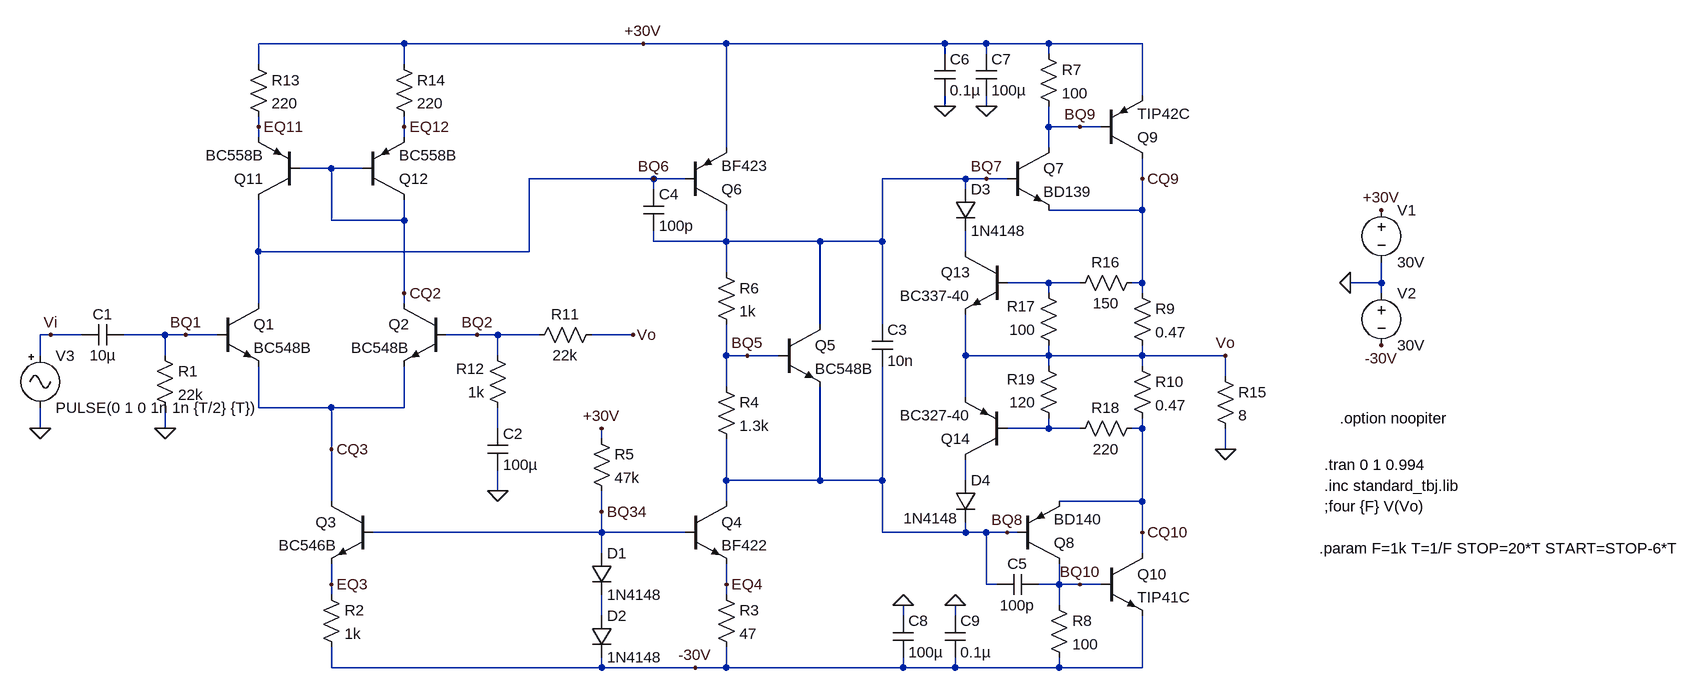
[diagram p0: schematic Clase_B_v3.asc]
Clase_B_v3.asc, the LTspice schematic file:
Version 4
SHEET 1 2480 1108
WIRE 96 -224 -128 -224
WIRE 464 -224 96 -224
WIRE 592 -224 464 -224
WIRE 928 -224 592 -224
WIRE 992 -224 928 -224
WIRE 1088 -224 992 -224
WIRE 1232 -224 1088 -224
WIRE 928 -208 928 -224
WIRE 992 -208 992 -224
WIRE 1088 -208 1088 -224
WIRE -128 -192 -128 -224
WIRE 96 -192 96 -224
WIRE 1232 -144 1232 -224
WIRE 928 -128 928 -144
WIRE 992 -128 992 -144
WIRE -128 -96 -128 -112
WIRE 96 -96 96 -112
WIRE 1088 -96 1088 -128
WIRE 1136 -96 1088 -96
WIRE 1168 -96 1136 -96
WIRE -128 -80 -128 -96
WIRE 96 -80 96 -96
WIRE 592 -64 592 -224
WIRE 1088 -64 1088 -96
WIRE -16 -32 -64 -32
WIRE 32 -32 -16 -32
WIRE 480 -16 288 -16
WIRE 528 -16 480 -16
WIRE 960 -16 832 -16
WIRE 992 -16 960 -16
WIRE 1024 -16 992 -16
WIRE 1232 -16 1232 -48
WIRE 480 0 480 -16
WIRE 960 0 960 -16
WIRE 1232 32 1232 -16
WIRE 1232 32 1088 32
WIRE -16 48 -16 -32
WIRE 96 48 96 16
WIRE 96 48 -16 48
WIRE 480 80 480 64
WIRE 592 80 592 32
WIRE 592 80 480 80
WIRE 736 80 592 80
WIRE 832 80 832 -16
WIRE 832 80 736 80
WIRE -128 96 -128 16
WIRE 288 96 288 -16
WIRE 288 96 -128 96
WIRE 960 96 960 64
WIRE 592 128 592 80
WIRE 1088 144 1024 144
WIRE 1136 144 1088 144
WIRE 1232 144 1232 32
WIRE 1232 144 1216 144
WIRE 1600 144 1600 112
WIRE 1600 144 1552 144
WIRE 96 160 96 48
WIRE 1088 160 1088 144
WIRE 1232 160 1232 144
WIRE 1600 160 1600 144
WIRE -128 176 -128 96
WIRE 96 176 96 160
WIRE 736 208 736 80
WIRE 832 208 832 80
WIRE -448 224 -464 224
WIRE -400 224 -448 224
WIRE -272 224 -336 224
WIRE -240 224 -272 224
WIRE -192 224 -240 224
WIRE 208 224 160 224
WIRE 240 224 208 224
WIRE 304 224 240 224
WIRE 448 224 384 224
WIRE -464 256 -464 224
WIRE -272 256 -272 224
WIRE 240 256 240 224
WIRE 592 256 592 208
WIRE 624 256 592 256
WIRE 672 256 624 256
WIRE 960 256 960 192
WIRE 1088 256 1088 240
WIRE 1088 256 960 256
WIRE 1232 256 1232 240
WIRE 1232 256 1088 256
WIRE 1360 256 1232 256
WIRE 1088 272 1088 256
WIRE 1232 272 1232 256
WIRE 1360 288 1360 256
WIRE 592 304 592 256
WIRE 960 320 960 256
WIRE -128 336 -128 272
WIRE -16 336 -128 336
WIRE 96 336 96 272
WIRE 96 336 -16 336
WIRE -464 368 -464 336
WIRE -272 368 -272 336
WIRE 240 368 240 336
WIRE 1088 368 1088 352
WIRE 1088 368 1024 368
WIRE 1136 368 1088 368
WIRE 1232 368 1232 352
WIRE 1232 368 1216 368
WIRE 400 384 400 368
WIRE -16 400 -16 336
WIRE 1360 400 1360 368
WIRE 592 448 592 384
WIRE 736 448 736 304
WIRE 736 448 592 448
WIRE 832 448 832 272
WIRE 832 448 736 448
WIRE 960 448 960 416
WIRE 240 464 240 432
WIRE -16 480 -16 400
WIRE 592 480 592 448
WIRE 1232 480 1232 368
WIRE 1232 480 1104 480
WIRE 400 496 400 464
WIRE 400 528 400 496
WIRE 400 528 48 528
WIRE 528 528 400 528
WIRE 832 528 832 448
WIRE 960 528 960 512
WIRE 960 528 832 528
WIRE 992 528 960 528
WIRE 1024 528 992 528
WIRE 1040 528 1024 528
WIRE 1232 528 1232 480
WIRE 400 560 400 528
WIRE 1232 560 1232 528
WIRE -16 608 -16 576
WIRE 592 608 592 576
WIRE 992 608 992 528
WIRE 1008 608 992 608
WIRE 1104 608 1104 576
WIRE 1104 608 1072 608
WIRE 1136 608 1104 608
WIRE 1168 608 1136 608
WIRE -16 624 -16 608
WIRE 592 624 592 608
WIRE 1104 640 1104 608
WIRE 400 656 400 624
WIRE 864 656 864 640
WIRE 944 656 944 640
WIRE -16 736 -16 704
WIRE 400 736 400 720
WIRE 400 736 -16 736
WIRE 544 736 400 736
WIRE 592 736 592 704
WIRE 592 736 544 736
WIRE 864 736 864 720
WIRE 864 736 592 736
WIRE 944 736 944 720
WIRE 944 736 864 736
WIRE 1104 736 1104 720
WIRE 1104 736 944 736
WIRE 1232 736 1232 656
WIRE 1232 736 1104 736
FLAG 1552 144 0
FLAG 1600 32 +30V
FLAG 464 -224 +30V
FLAG 1600 240 -30V
FLAG 544 736 -30V
FLAG 240 464 0
FLAG -464 368 0
FLAG 1360 256 Vo
FLAG -448 224 Vi
FLAG 480 -16 BQ6
FLAG -16 400 CQ3
FLAG -16 608 EQ3
FLAG 400 496 BQ34
FLAG 592 608 EQ4
FLAG 992 -16 BQ7
FLAG 1024 528 BQ8
FLAG 1136 -96 BQ9
FLAG 1136 608 BQ10
FLAG 1232 528 CQ10
FLAG 1232 -16 CQ9
FLAG -272 368 0
FLAG 448 224 Vo
FLAG -128 -96 EQ11
FLAG 96 -96 EQ12
FLAG 96 160 CQ2
FLAG 208 224 BQ2
FLAG -240 224 BQ1
FLAG 624 256 BQ5
FLAG 400 368 +30V
FLAG 992 -128 0
FLAG 864 640 0
FLAG 928 -128 0
FLAG 944 640 0
FLAG 1360 400 0
SYMBOL npn -192 176 R0
SYMATTR InstName Q1
SYMATTR Value BC548B
SYMBOL npn 160 176 M0
SYMATTR InstName Q2
SYMATTR Value BC548B
SYMBOL npn 48 480 M0
SYMATTR InstName Q3
SYMATTR Value BC546B
SYMBOL npn 528 480 R0
SYMATTR InstName Q4
SYMATTR Value BF422
SYMBOL npn 672 208 R0
SYMATTR InstName Q5
SYMATTR Value BC548B
SYMBOL pnp 528 32 M180
SYMATTR InstName Q6
SYMATTR Value BF423
SYMBOL res 576 112 R0
SYMATTR InstName R6
SYMATTR Value 1k
SYMBOL res 576 288 R0
SYMATTR InstName R4
SYMATTR Value 1.3k
SYMBOL diode 384 560 R0
SYMATTR InstName D1
SYMATTR Value 1N4148
SYMBOL diode 384 656 R0
SYMATTR InstName D2
SYMATTR Value 1N4148
SYMBOL res -32 608 R0
SYMATTR InstName R2
SYMATTR Value 1k
SYMBOL res 576 608 R0
SYMATTR InstName R3
SYMATTR Value 47
SYMBOL res 384 368 R0
SYMATTR InstName R5
SYMATTR Value 47k
SYMBOL voltage 1600 16 R0
WINDOW 123 0 0 Left 2
WINDOW 39 0 0 Left 2
SYMATTR InstName V1
SYMATTR Value 30V
SYMBOL voltage 1600 144 R0
SYMATTR InstName V2
SYMATTR Value 30V
SYMBOL res 1216 144 R0
SYMATTR InstName R9
SYMATTR Value 0.47
SYMBOL res 1216 256 R0
SYMATTR InstName R10
SYMATTR Value 0.47
SYMBOL npn 1024 -64 R0
SYMATTR InstName Q7
SYMATTR Value BD139
SYMBOL pnp 1168 -48 M180
SYMATTR InstName Q9
SYMATTR Value TIP42C
SYMBOL res 1072 -224 R0
SYMATTR InstName R7
SYMATTR Value 100
SYMBOL pnp 1040 576 M180
SYMATTR InstName Q8
SYMATTR Value BD140
SYMBOL npn 1168 560 R0
SYMATTR InstName Q10
SYMATTR Value TIP41C
SYMBOL res 1088 624 R0
SYMATTR InstName R8
SYMATTR Value 100
SYMBOL res 400 208 R90
WINDOW 0 0 56 VBottom 2
WINDOW 3 32 56 VTop 2
SYMATTR InstName R11
SYMATTR Value 22k
SYMBOL res 256 352 R180
WINDOW 0 36 76 Left 2
WINDOW 3 36 40 Left 2
SYMATTR InstName R12
SYMATTR Value 1k
SYMBOL cap 464 0 R0
SYMATTR InstName C4
SYMATTR Value 100p
SYMBOL cap 224 368 R0
SYMATTR InstName C2
SYMATTR Value 100µ
SYMBOL cap -400 240 R270
WINDOW 0 32 32 VTop 2
WINDOW 3 0 32 VBottom 2
SYMATTR InstName C1
SYMATTR Value 10µ
SYMBOL res -288 240 R0
SYMATTR InstName R1
SYMATTR Value 22k
SYMBOL pnp -64 16 R180
SYMATTR InstName Q11
SYMATTR Value BC558B
SYMBOL pnp 32 16 M180
SYMATTR InstName Q12
SYMATTR Value BC558B
SYMBOL res -144 -208 R0
SYMATTR InstName R13
SYMATTR Value 220
SYMBOL res 80 -208 R0
SYMATTR InstName R14
SYMATTR Value 220
SYMBOL cap 1072 592 R90
WINDOW 0 0 32 VBottom 2
WINDOW 3 32 32 VTop 2
SYMATTR InstName C5
SYMATTR Value 100p
SYMBOL cap 816 208 R0
SYMATTR InstName C3
SYMATTR Value 10n
SYMBOL cap 976 -208 R0
SYMATTR InstName C7
SYMATTR Value 100µ
SYMBOL cap 848 656 R0
SYMATTR InstName C8
SYMATTR Value 100µ
SYMBOL Misc\\signal -464 240 R0
WINDOW 123 0 0 Left 0
WINDOW 39 0 0 Left 0
SYMATTR InstName V3
SYMATTR Value PULSE(0 1 0 1n 1n {T/2} {T})
SYMBOL res 1232 128 R90
WINDOW 0 0 56 VBottom 2
WINDOW 3 32 56 VTop 2
SYMATTR InstName R16
SYMATTR Value 150
SYMBOL res 1104 256 R180
WINDOW 0 36 76 Left 2
WINDOW 3 36 40 Left 2
SYMATTR InstName R17
SYMATTR Value 100
SYMBOL res 1120 384 R270
WINDOW 0 32 56 VTop 2
WINDOW 3 0 56 VBottom 2
SYMATTR InstName R18
SYMATTR Value 220
SYMBOL res 1104 368 R180
WINDOW 0 36 76 Left 2
WINDOW 3 36 40 Left 2
SYMATTR InstName R19
SYMATTR Value 120
SYMBOL npn 1024 96 M0
SYMATTR InstName Q13
SYMATTR Value BC337-40
SYMBOL pnp 1024 416 R180
SYMATTR InstName Q14
SYMATTR Value BC327-40
SYMBOL diode 944 0 R0
SYMATTR InstName D3
SYMATTR Value 1N4148
SYMBOL diode 944 448 R0
WINDOW 3 -80 58 Left 2
SYMATTR Value 1N4148
SYMATTR InstName D4
SYMBOL cap 912 -208 R0
SYMATTR InstName C6
SYMATTR Value 0.1µ
SYMBOL cap 928 656 R0
SYMATTR InstName C9
SYMATTR Value 0.1µ
SYMBOL res 1344 272 R0
SYMATTR InstName R15
SYMATTR Value 8
TEXT 1512 456 Left 2 !.inc standard_tbj.lib
TEXT 1512 488 Left 2 !;four {F} V(Vo)
TEXT 1504 552 Left 2 !.param F=1k T=1/F STOP=20*T START=STOP-6*T
TEXT 1512 424 Left 2 !.tran 0 1 0.994
TEXT 1536 352 Left 2 !.option noopiter

The netlist it stands for:
* Clase_B_v3.asc
Q1 BQ6 BQ1 CQ3 0 BC548B
Q2 CQ2 BQ2 CQ3 0 BC548B
Q3 CQ3 BQ34 EQ3 0 BC546B
Q4 BQ8 BQ34 EQ4 0 BF422
Q5 BQ7 BQ5 BQ8 0 BC548B
Q6 BQ7 BQ6 +30V 0 BF423
R6 BQ7 BQ5 1k
R4 BQ5 BQ8 1.3k
D1 BQ34 N006 1N4148
D2 N006 -30V 1N4148
R2 EQ3 -30V 1k
R3 EQ4 -30V 47
R5 +30V BQ34 47k
V1 +30V 0 30V
V2 0 -30V 30V
R9 CQ9 Vo 0.47
R10 Vo CQ10 0.47
Q7 BQ9 BQ7 CQ9 0 BD139
Q9 CQ9 BQ9 +30V 0 TIP42C
R7 +30V BQ9 100
Q8 BQ10 BQ8 CQ10 0 BD140
Q10 CQ10 BQ10 -30V 0 TIP41C
R8 BQ10 -30V 100
R11 Vo BQ2 22k
R12 N003 BQ2 1k
C4 BQ6 BQ7 100p
C2 N003 0 100µ
C1 Vi BQ1 10µ
R1 BQ1 0 22k
Q11 BQ6 CQ2 EQ11 0 BC558B
Q12 CQ2 CQ2 EQ12 0 BC558B
R13 +30V EQ11 220
R14 +30V EQ12 220
C5 BQ10 BQ8 100p
C3 BQ7 BQ8 10n
C7 +30V 0 100µ
C8 0 -30V 100µ
V3 Vi 0 PULSE(0 1 0 1n 1n {T/2} {T})
R16 CQ9 N002 150
R17 Vo N002 100
R18 N004 CQ10 220
R19 N004 Vo 120
Q13 N001 N002 Vo 0 BC337-40
Q14 N005 N004 Vo 0 BC327-40
D3 BQ7 N001 1N4148
D4 N005 BQ8 1N4148
C6 +30V 0 0.1µ
C9 0 -30V 0.1µ
R15 Vo 0 8
.model D D
.lib standard.dio
.model NPN NPN
.model PNP PNP
.lib standard.bjt
.inc standard_tbj.lib
;four {F} V(Vo)
.param F=1k T=1/F STOP=20*T START=STOP-6*T
.tran 0 1 0.994
.option noopiter
.backanno
.end